# Altium schematic sheet 5.USB.SchDoc
size A3
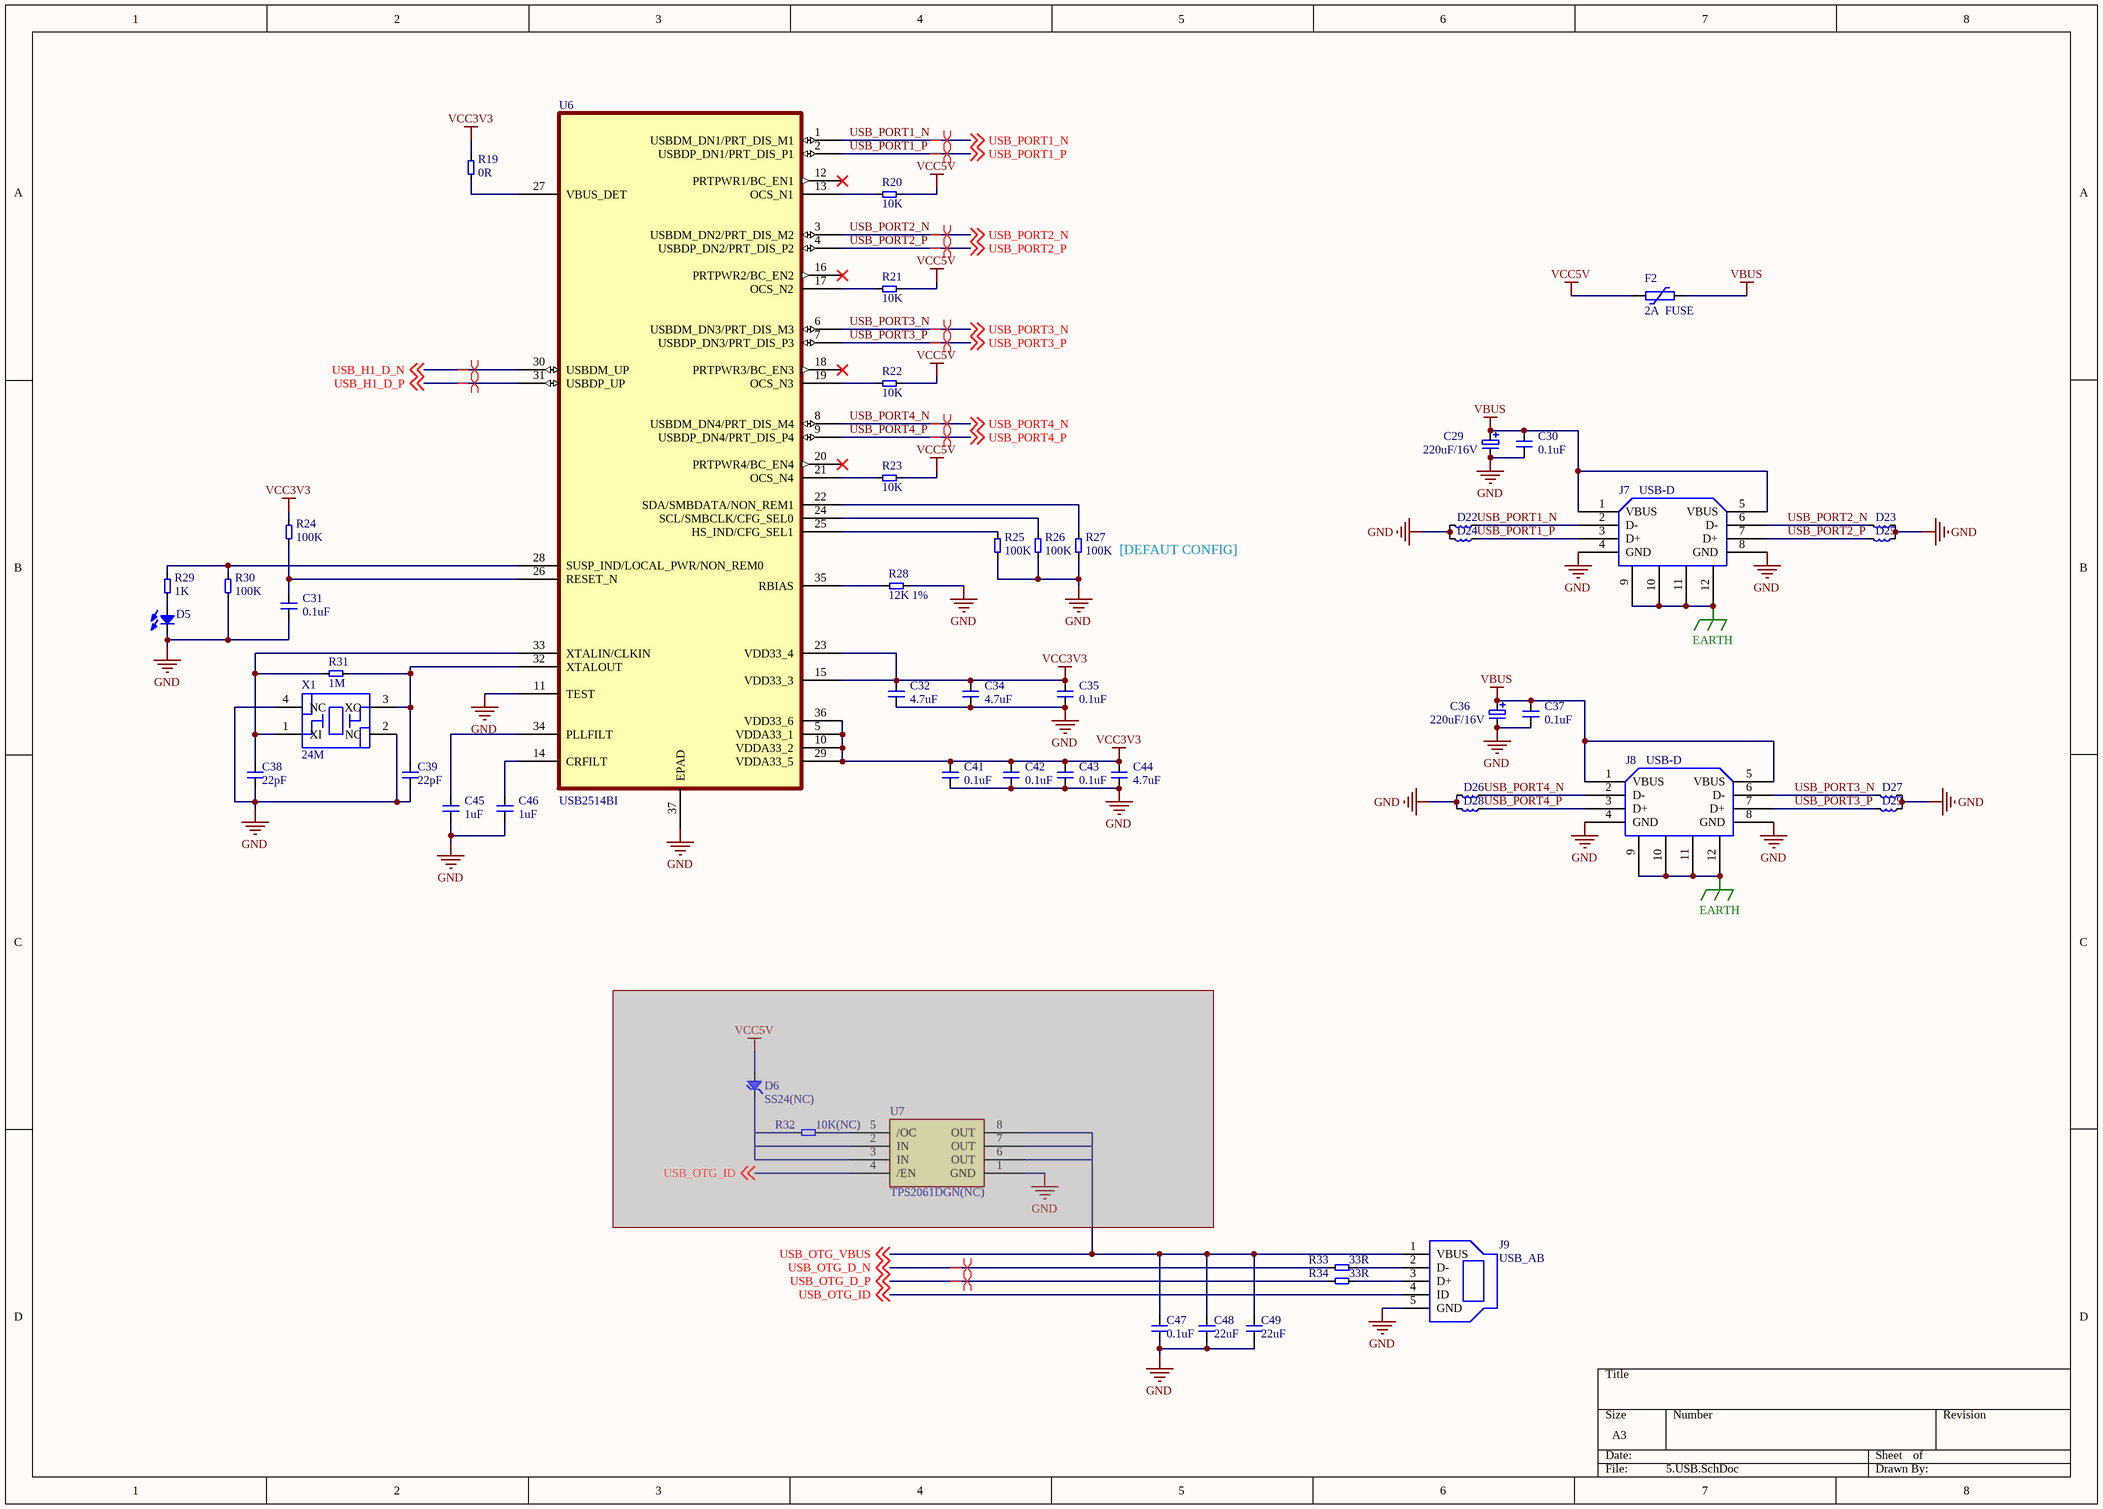
[diagram p0: 5.USB.SchDoc]

## Parts
C29  220uF/16V  [C6.3x5.4-SMD]
C30  0.1uF  [0603C]
C31  0.1uF  [0603C]
C32  4.7uF  [0603C]
C34  4.7uF  [0603C]
C35  0.1uF  [0603C]
C36  220uF/16V  [C6.3x5.4-SMD]
C37  0.1uF  [0603C]
C38  22pF  [0603C]
C39  22pF  [0603C]
C41  0.1uF  [0603C]
C42  0.1uF  [0603C]
C43  0.1uF  [0603C]
C44  4.7uF  [0603C]
C45  1uF  [0603C]
C46  1uF  [0603C]
C47  0.1uF  [0603C]
C48  22uF  [0603C]
C49  22uF  [0603C]
D5  发光二极管  [0603D]  (value not drawn)
D6  SS24(NC)  [SMA]  (masked out: inside a compile mask, not in the netlist)
D22  ESD  [0603L]  (value not drawn)
D23  ESD  [0603L]  (value not drawn)
D24  ESD  [0603L]  (value not drawn)
D25  ESD  [0603L]  (value not drawn)
D26  ESD  [0603L]  (value not drawn)
D27  ESD  [0603L]  (value not drawn)
D28  ESD  [0603L]  (value not drawn)
D29  ESD  [0603L]  (value not drawn)
F2  2A  FUSE  [1812F]
J7  USB-D  [USB-D]
J8  USB-D  [USB-D]
J9  USB_AB  [MINI USB B]
R19  0R  [0603R]
R20  10K  [0603R]
R21  10K  [0603R]
R22  10K  [0603R]
R23  10K  [0603R]
R24  100K  [0603R]
R25  100K  [0603R]
R26  100K  [0603R]
R27  100K  [0603R]
R28  12K 1%  [0603R]
R29  1K  [0603R]
R30  100K  [0603R]
R31  1M  [0603R]
R32  10K(NC)  [0603R]  (masked out: inside a compile mask, not in the netlist)
R33  33R  [0603R]
R34  33R  [0603R]
U6  USB2514BI  [QFN-36]
U7  TPS2061DGN(NC)  [MSOP-8]  (masked out: inside a compile mask, not in the netlist)
X1  24M  [OSC4-3225]

## Nets
EARTH: J7.9 J7.10 J7.11 J7.12 J8.9 J8.10 J8.11 J8.12 J9.6(9) J9.7(9) J9.8(9) J9.9
GND: C29.2 C30.1 C31.1 C32.1 C34.1 C35.1 C36.2 C37.1 C38.1 C39.1 C41.1 C42.1 C43.1 C44.1 C45.1 C46.1 C47.1 C48.1 C49.1 D5.K D22.2 D23.1 D24.2 D25.1 D26.2 D27.1 D28.2 D29.1 J7.4(GND) J7.8(GND) J8.4(GND) J8.8(GND) J9.5(GND) R25.2 R26.2 R27.2 R28.1 R30.2 U6.11(TEST) U6.37(EPAD) X1.2(NC) X1.4(NC)
VBUS: C29.1 C30.2 C36.1 C37.2 F2.2 J7.1(VBUS) J7.5(VBUS) J8.1(VBUS) J8.5(VBUS)
VCC3V3: C32.2 C34.2 C35.2 C41.2 C42.2 C43.2 C44.2 R19.2 R24.1 U6.5(VDDA33_1) U6.10(VDDA33_2) U6.15(VDD33_3) U6.23(VDD33_4) U6.29(VDDA33_5) U6.36(VDD33_6)
VCC5V: F2.1 R20.1 R21.1 R22.1 R23.1
USB_H1_D_N: U6.30(USBDM_UP) ; off-sheet USB_H1_D_N
USB_H1_D_P: U6.31(USBDP_UP) ; off-sheet USB_H1_D_P
USB_OTG_D_N: R33.2 ; off-sheet USB_OTG_D_N
USB_OTG_D_P: R34.2 ; off-sheet USB_OTG_D_P
USB_OTG_ID: J9.4(ID) ; off-sheet USB_OTG_ID
USB_OTG_VBUS: C47.2 C48.2 C49.2 J9.1(VBUS) ; off-sheet USB_OTG_VBUS
USB_PORT1_N: D22.1 J7.2(D-) U6.1(USBDM_DN1/PRT_DIS_M1) ; off-sheet USB_PORT1_N
USB_PORT1_P: D24.1 J7.3(D+) U6.2(USBDP_DN1/PRT_DIS_P1) ; off-sheet USB_PORT1_P
USB_PORT2_N: D23.2 J7.6(D-) U6.3(USBDM_DN2/PRT_DIS_M2) ; off-sheet USB_PORT2_N
USB_PORT2_P: D25.2 J7.7(D+) U6.4(USBDP_DN2/PRT_DIS_P2) ; off-sheet USB_PORT2_P
USB_PORT3_N: D27.2 J8.6(D-) U6.6(USBDM_DN3/PRT_DIS_M3) ; off-sheet USB_PORT3_N
USB_PORT3_P: D29.2 J8.7(D+) U6.7(USBDP_DN3/PRT_DIS_P3) ; off-sheet USB_PORT3_P
USB_PORT4_N: D26.1 J8.2(D-) U6.8(USBDM_DN4/PRT_DIS_M4) ; off-sheet USB_PORT4_N
USB_PORT4_P: D28.1 J8.3(D+) U6.9(USBDP_DN4/PRT_DIS_P4) ; off-sheet USB_PORT4_P
NetC31_2: C31.2 R24.2 U6.26(RESET_N)
NetC38_2: C38.2 R31.1 U6.33(XTALIN/CLKIN) X1.1(XI)
NetC39_2: C39.2 R31.2 U6.32(XTALOUT) X1.3(XO)
NetC45_2: C45.2 U6.34(PLLFILT)
NetC46_2: C46.2 U6.14(CRFILT)
NetD5_A: D5.A R29.1
NetJ9_2: J9.2(D-) R33.1
NetJ9_3: J9.3(D+) R34.1
NetR19_1: R19.1 U6.27(VBUS_DET)
NetR20_2: R20.2 U6.13(OCS_N1)
NetR21_2: R21.2 U6.17(OCS_N2)
NetR22_2: R22.2 U6.19(OCS_N3)
NetR23_2: R23.2 U6.21(OCS_N4)
NetR25_1: R25.1 U6.25(HS_IND/CFG_SEL1)
NetR26_1: R26.1 U6.24(SCL/SMBCLK/CFG_SEL0)
NetR27_1: R27.1 U6.22(SDA/SMBDATA/NON_REM1)
NetR28_2: R28.2 U6.35(RBIAS)
NetR29_2: R29.2 R30.1 U6.28(SUSP_IND/LOCAL_PWR/NON_REM0)

Not connected (* = marked no-connect by the designer): U6 12(PRTPWR1/BC_EN1)* 16(PRTPWR2/BC_EN2)* 18(PRTPWR3/BC_EN3)* 20(PRTPWR4/BC_EN4)*

## Layout directives
differential pair: USB_H1_D_N, USB_H1_D_P, USB_OTG_D_N, USB_OTG_D_P, USB_PORT1_N, USB_PORT1_P, USB_PORT2_N, USB_PORT2_P, USB_PORT3_N, USB_PORT3_P, USB_PORT4_N, USB_PORT4_P

## Notes on the sheet
- (near R27) [DEFAUT CONFIG]

## Library data of the parts
C29 C36 = 直插电解电容
C30-C32 C34 C35 C37-C39 C41-C49 = 电容
D6 = SS24: DIODES: *
D22-D29 = 电感
F2 = FUSE: 贴片自恢复保险丝
J7 J8 = USB-D: USB DOUBLE PORTS
J9 = USB_AB: 小USB插痤
R19-R34 = 电阻
U6 = USB2514
U7 = TPS2061: TPS2061DGN
X1 = 表贴晶体: 4PIN表贴晶体